# EAGLE design dualpowersupply (EAGLE 9.6.2)
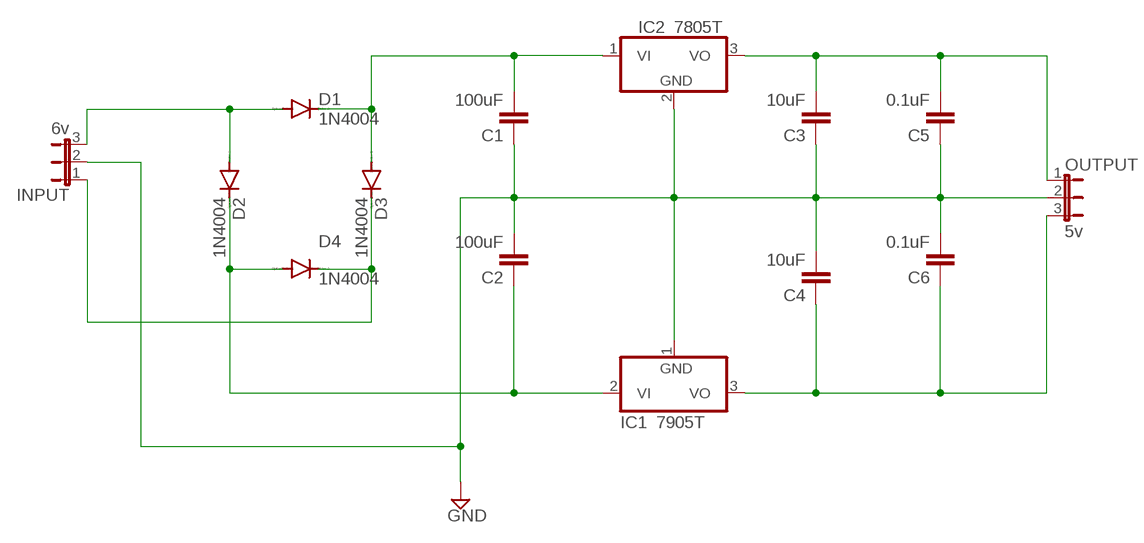
[diagram p0: schematic, sheet 1]

## Parts
C1  100uF  C2.5/2  [C2.5-2]
C2  100uF  C2.5/2  [C2.5-2]
C3  10uF  C2.5/2  [C2.5-2]
C4  10uF  C2.5/2  [C2.5-2]
C5  0.1uF  C2.5/2  [C2.5-2]
C6  0.1uF  C2.5/2  [C2.5-2]
D1  1N4004  [DO41-10]
D2  1N4004  [DO41-10]
D3  1N4004  [DO41-10]
D4  1N4004  [DO41-10]
IC1  7905T  7908T  [TO220H]
IC2  7805T  [TO220H]
INPUT  6v  JP2E  [JP2]
OUTPUT  5v  JP2E  [JP2]

## Nets
GND: C1.1 C2.2 C3.1 C4.2 C5.1 C6.2 IC1.1(GND) IC2.2(GND) INPUT.2 OUTPUT.2
N$1: D1.A D2.A INPUT.3
N$2: C2.1 D2.C D4.A IC1.2(VI)
N$3: D3.C D4.C INPUT.1
N$4: C1.2 D1.C D3.A IC2.1(VI)
N$9: C4.1 C6.1 IC1.3(VO) OUTPUT.3
N$11: C3.2 C5.2 IC2.3(VO) OUTPUT.1

## Library data of the parts
C1-C6 = capacitor-wima:C: CAPACITOR naming: grid - package width
D1-D4 = diode:1N4004: DIODE general purpose rectifier, 1 A
IC1 = linear:79*: Negative VOLTAGE REGULATOR
IC2 = linear:78*: Positive VOLTAGE REGULATOR Source: http://cache.national.com/ds/LM/LM78L05.pdf http://www.fairchildsemi.com/ds/LM/LM7805.pdf
INPUT OUTPUT = jumper:JP2E: JUMPER

## Board
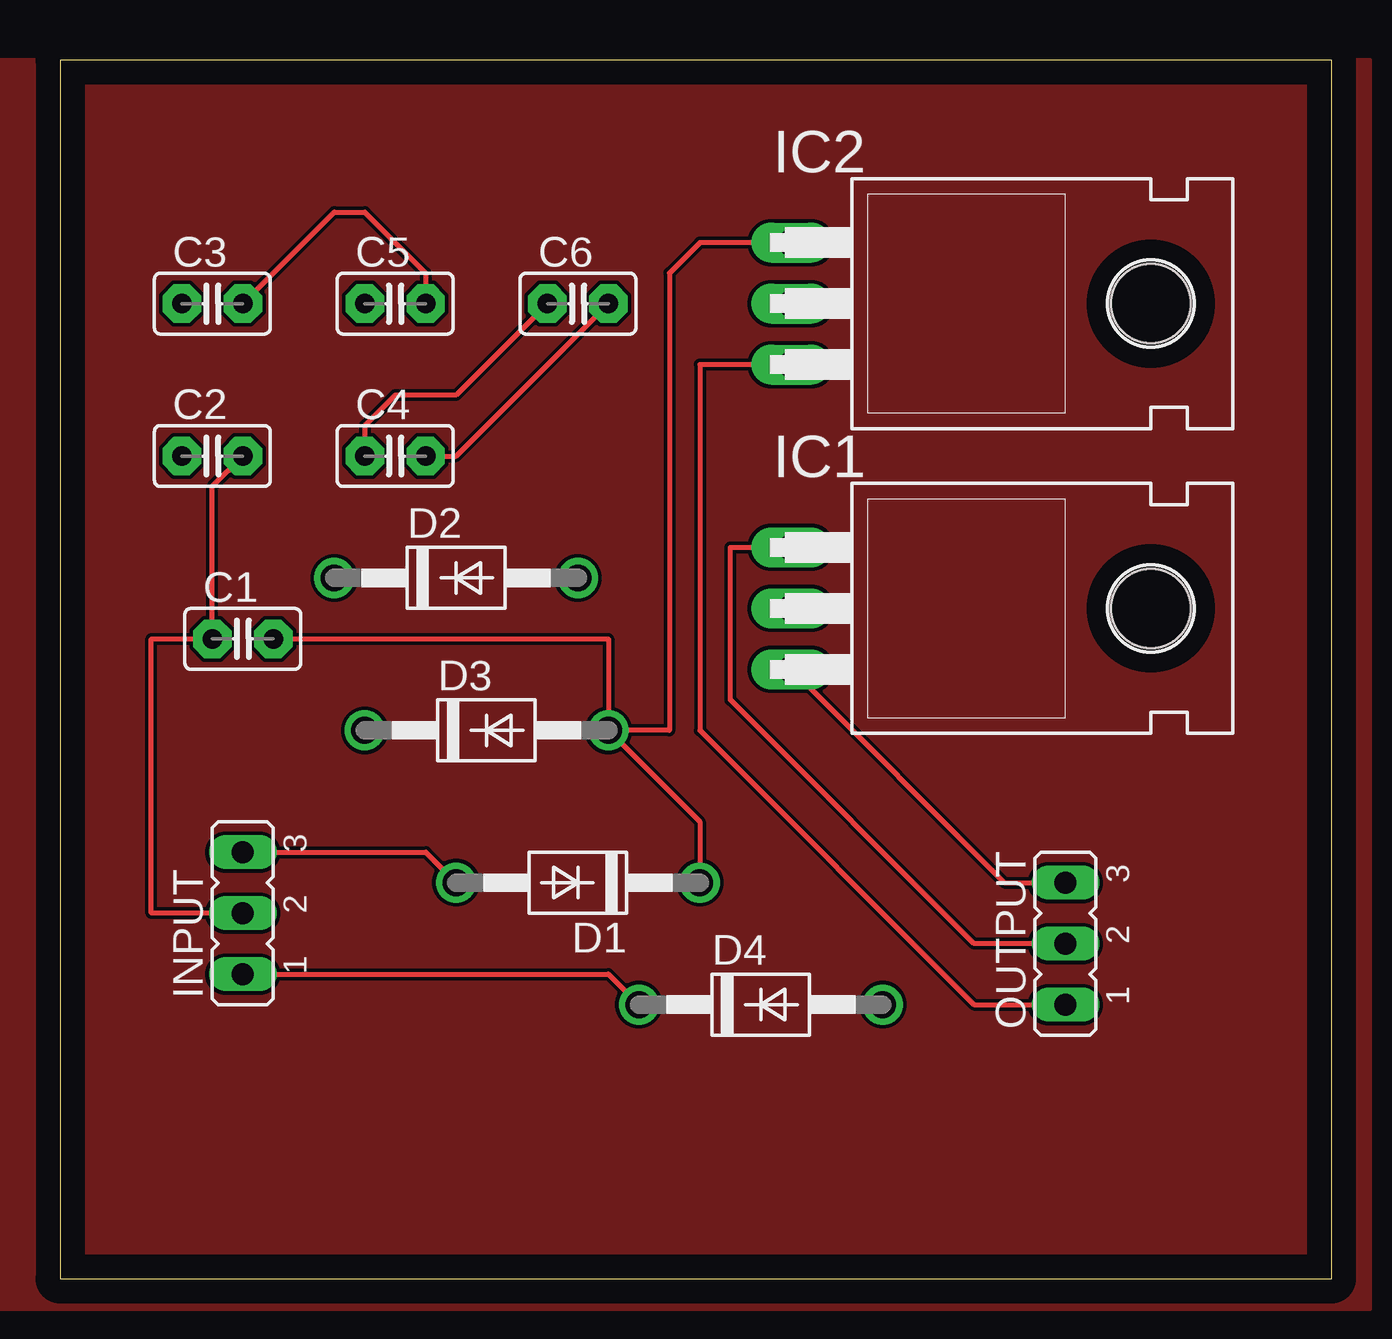
[diagram p1: board, top side]
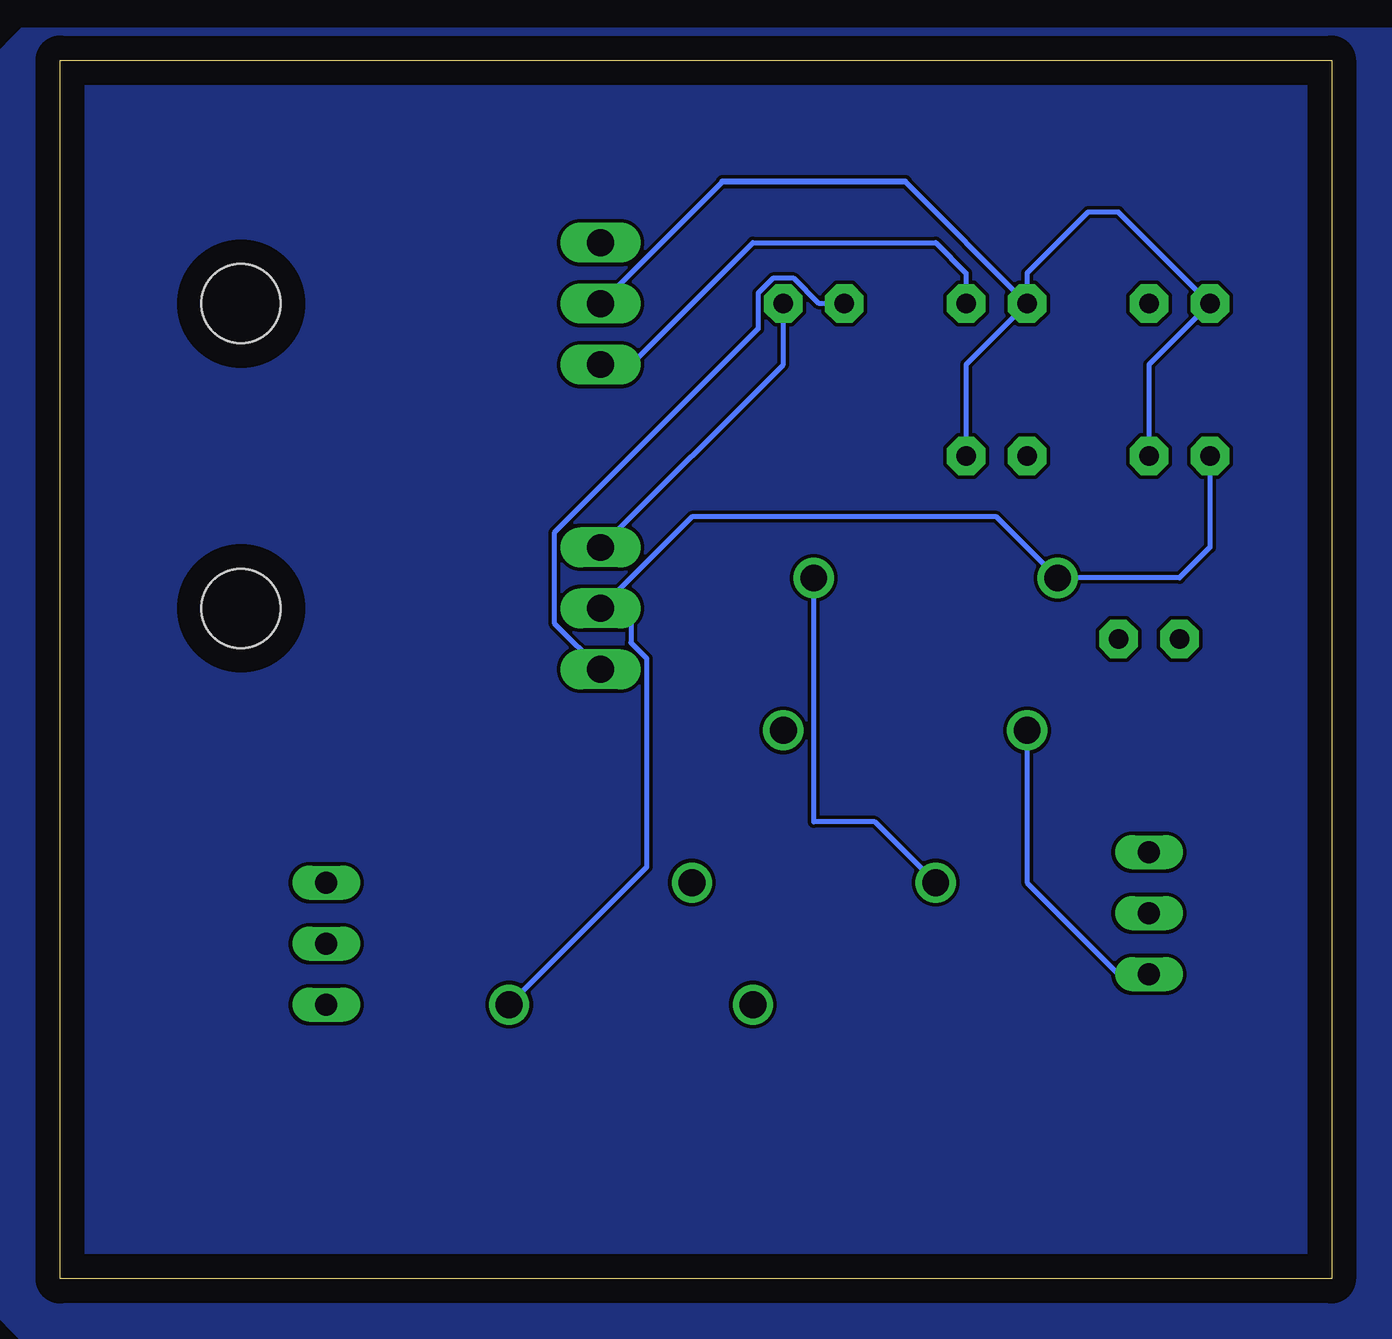
[diagram p2: board, bottom side, seen from below]

Size 53.01 x 50.79 mm. Coordinates in mm from the lower left corner, seen from the top.
Outline: 0,0 53.01,0 53.01,50.79 0,50.79 0,0
Copper layers (1*16): Top 0.035mm / dielectric 1.5mm / Bottom 0.035mm
Design rules "default": minimum track width 6mil, minimum drill 0.35mm, track to track 6mil, track to pad 6mil, pad to pad 6mil, via to via 6mil, smd to smd 6mil, copper to edge 40mil, drill to drill 6mil, minimum pad ring 10mil, minimum via ring 8mil, stop-mask expansion 4mil, vias tented up to drill 0mil, thermal gap 10mil

### Footprints (pad centres in the part's own frame; a part is rotated, then mirrored left to right if it is on the bottom)
C2.5-2 = drill 0.813 pad 1.6 octagon: 1 -1.27,0; 2 1.27,0
DO41-10 = drill 1.118: A 5.08,0; C -5.08,0
TO220H = drill 1.118 long: 1 -2.54,-10.16; 2 0,-10.16; 3 2.54,-10.16 | hole 3.302: 0,4.826
JP2 = drill 0.914 long: 1 -2.54,0; 2 0,0; 3 2.54,0

### Placement (x,y rotation side)
C1  7.62,26.67 0 top
C2  6.35,34.29 0 top
C3  6.35,40.64 0 top
C4  13.97,34.29 0 top
C5  13.97,40.64 0 top
C6  21.59,40.64 0 top
D1  21.59,16.51 180 top
D2  16.51,29.21 0 top
D3  17.78,22.86 0 top
D4  29.21,11.43 0 top
IC1  40.64,27.94 270 top
IC2  40.64,40.64 270 top
INPUT  7.62,15.24 90 top
OUTPUT  41.91,13.97 90 top

### Tracks (layer width: path | path; a pad name or v marks a point on that pad's centre or on a via)
BOTTOM
  pour Bottom: -3.81,52.07 54.61,52.07 55.88,50.8 55.88,-1.27 54.61,-2.54 -5.08,-2.54 -5.08,50.8
GND
  Top 0.203: INPUT.2 3.81,15.24 3.81,26.67 C1.1 6.35,33.02 C2.2 | C4.2 16.51,34.29 C6.2 | OUTPUT.2 38.1,13.97 27.94,24.13 27.94,30.48 IC1.1
  Bottom 0.203: C2.2 7.62,38.1 C3.1 8.89,44.45 10.16,44.45 12.7,41.91 C5.1 | C5.1 15.24,38.1 C4.2 | C5.1 17.78,45.72 | 25.4,45.72 IC2.2 | IC1.1 22.86,38.1 C6.2
  Bottom 0.254: 17.78,45.72 25.4,45.72
N$1
  Top 0.203: INPUT.3 15.24,17.78 D1.A
  Bottom 0.203: D1.A 19.05,19.05 21.59,19.05 D2.A
N$2
  Bottom 0.203: C2.1 5.08,30.48 6.35,29.21 D2.C 13.97,31.75 26.67,31.75 IC1.2 29.21,27.94 29.21,26.51 28.55,25.85 28.55,17.17 D4.A
N$3
  Top 0.203: INPUT.1 22.86,12.7 D4.C
  Bottom 0.203: D3.C 12.7,16.51 8.89,12.7 INPUT.1
N$4
  Top 0.203: C1.2 22.86,26.67 D3.A | IC2.1 26.67,43.18 25.4,41.91 25.4,22.86 D3.A | D3.A 26.67,19.05 D1.C
N$9
  Top 0.203: IC1.3 39.37,16.51 OUTPUT.3 | C6.1 16.51,36.83 13.97,36.83 12.7,35.56 C4.1
  Bottom 0.203: C6.1 21.37,40.64 22.42,41.69 23.3,41.69 23.91,41.08 23.91,39.59 32.41,31.09 32.41,27.33 IC1.3
N$11
  Top 0.203: 30.48,38.26 IC2.3 26.67,38.1 26.67,22.86 38.1,11.43 OUTPUT.1 | C3.2 11.43,44.45 12.7,44.45 15.24,41.91 C5.2
  Bottom 0.203: IC2.3 29.21,38.1 24.13,43.18 16.51,43.18 15.24,41.91 C5.2
TOP
  pour Top: -2.54,50.8 54.61,50.8 54.61,-1.27 -2.54,-1.27 -3.81,-2.54 -3.81,49.53